# Altium schematic sheet SH1 - CONNECTORS.SchDoc: CONNECTORS
size 279 x 215 mm; CheckedBy: Lance Bantoto; Engineer: Taylor McNabb; Revision: 1; SheetNumber: 1; SheetTotal: 4
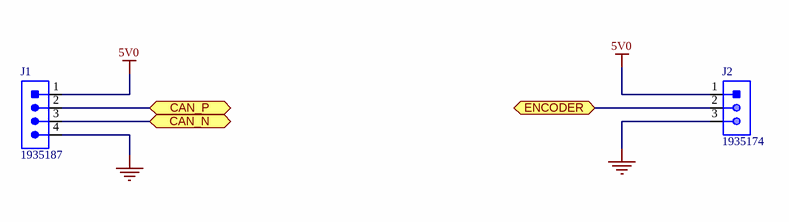
[diagram p0: SH1 - CONNECTORS.SchDoc]

## Parts
J1  CON_4POS_SCREW_TERM  [1935187]  (value not drawn)
J2  CON_3POS_SCREW_TERM  [1935174]  (value not drawn)

## Ports
CAN_N (bidir), CAN_P (bidir), ENCODER (bidir)

## Nets
5V0: J1.1 J2.1
GND: J1.4 J2.3
CAN_N: J1.3 ; port CAN_N
CAN_P: J1.2 ; port CAN_P
ENCODER: J2.2 ; port ENCODER

## Notes on the sheet
- University of Waterloo Robotics Team
- 200 University Ave W
- REV
- PROJECT
- Waterloo, Ontario, Canada
- N2L 3G1
- DOCUMENT
- ENGINEER
- REVIEWER
- MODIFIED
- SHEET
- OF

## Library data of the parts
J1 = CON_4POS_SCREW_TERM: TERM BLK 4POS SIDE ENTRY 5MM; Manufacturer 1: Phoenix Contact; Wire Gauge: 12-26AWG; Package/Footprint: TH; Screw Thread: M2.6; Supplier Part Number 1: 277-1579-ND; Supplier 1: Digi-Key; Pitch: 5mm; Mounting Type: TH; Manufacturer Part Number 1: 1935187
J2 = CON_3POS_SCREW_TERM: TERM BLK 3POS SIDE ENTRY 5MM; Manufacturer 1: Phoenix Contact; Package/Footprint: TH; Voltage Rating: 250V; Current Rating: 17.5A; Supplier 1: Digi-Key; Mounting Type: TH; Orientation: Straight; Pitch: 5mm; Supplier Part Number 1: 277-1578-ND; Manufacturer Part Number 1: 1935174